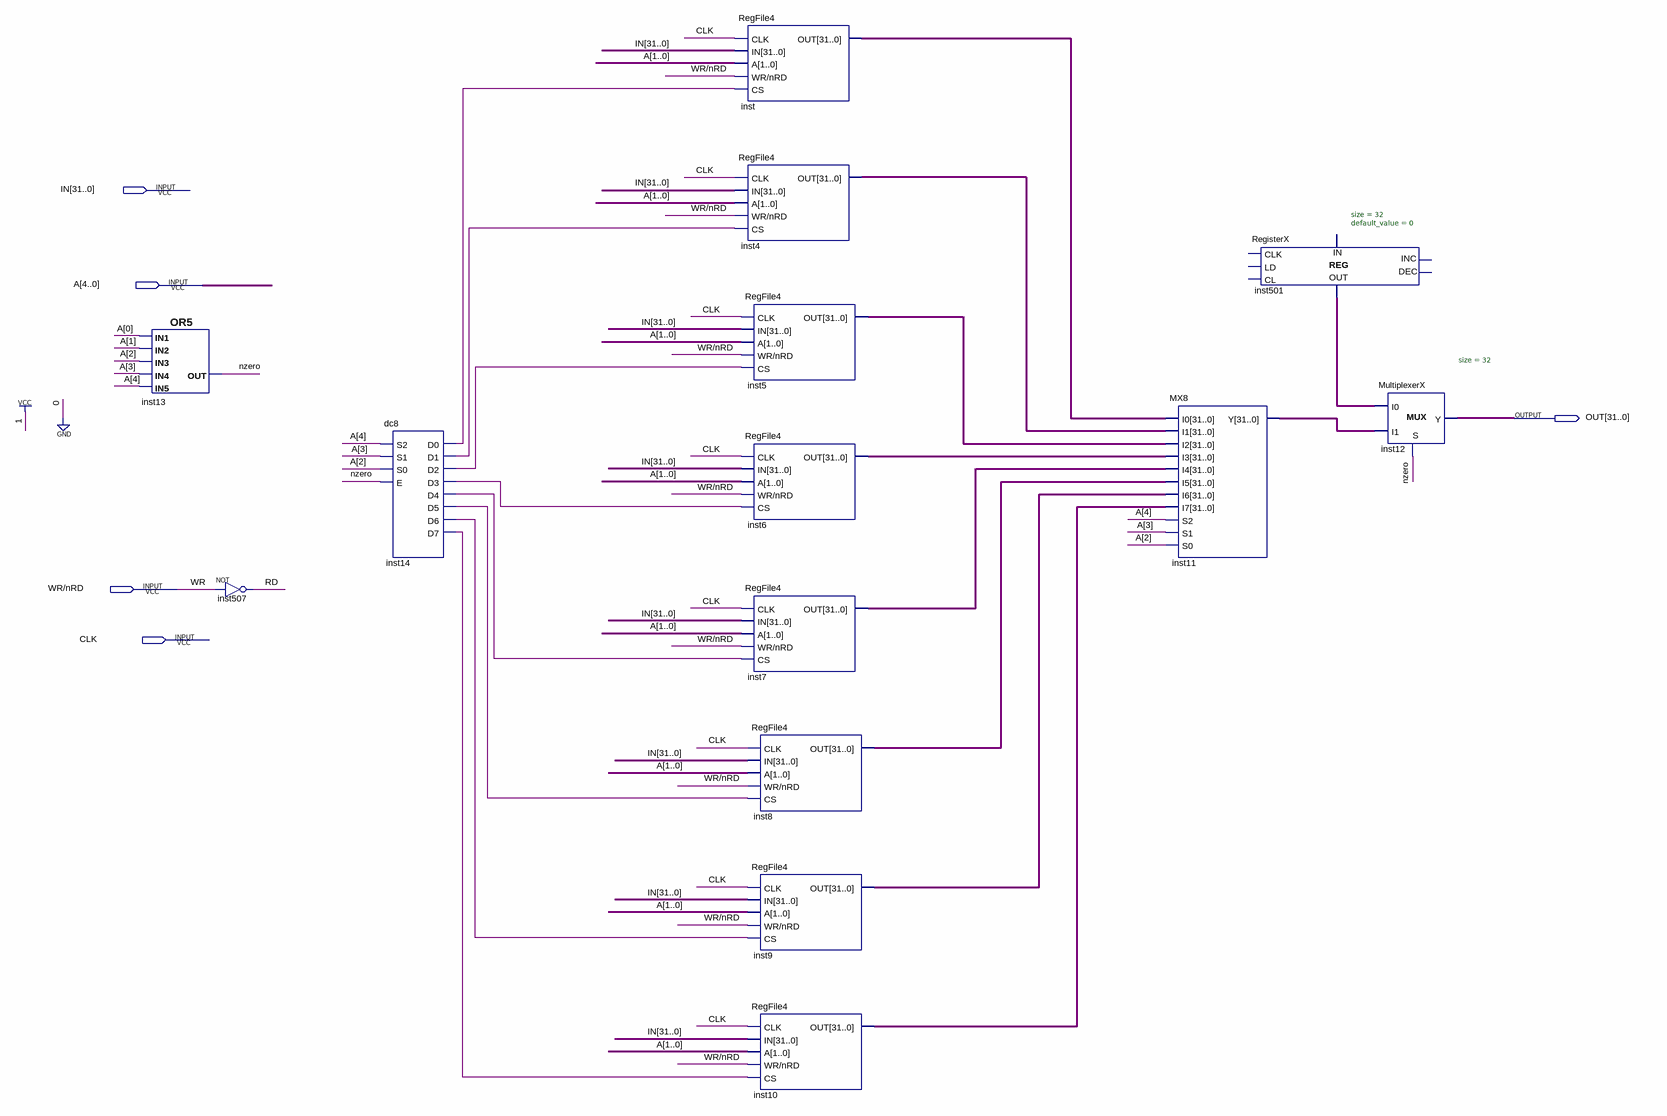
[diagram p0: schematic sheet]
// Quartus schematic RegFile32.bdf as structural Verilog: 14 symbols, 5 pins
module RegFile32 (
  input  [31:0] IN,
  input  [4:0] A,
  input  \WR/nRD ,
  input  CLK,
  output [31:0] OUT
);

  wire inst14_d0, inst14_d1, inst14_d2, inst14_d3, inst14_d4, inst14_d5, inst14_d6, inst14_d7, nzero, RD;
  wire [31:0] inst4_out, inst5_out, inst6_out, inst7_out, inst8_out, inst9_out, inst10_out, inst11_y,
       inst501_data_out, inst_out;

  or inst13 (nzero, A[0], A[1], A[2], A[3], A[4]);
  not inst507 (RD, \WR/nRD );
  dc8 inst14 (
    .S2(A[4]), .S1(A[3]), .S0(A[2]), .E(nzero), .D0(inst14_d0), .D1(inst14_d1), .D2(inst14_d2),
    .D3(inst14_d3), .D4(inst14_d4), .D5(inst14_d5), .D6(inst14_d6), .D7(inst14_d7));
  RegFile4 inst (.CLK(CLK), .IN(IN), .A(A[1:0]), .\WR/nRD (\WR/nRD ), .CS(inst14_d0), .OUT(inst_out));
  RegFile4 inst4 (.CLK(CLK), .IN(IN), .A(A[1:0]), .\WR/nRD (\WR/nRD ), .CS(inst14_d1), .OUT(inst4_out));
  RegFile4 inst5 (.CLK(CLK), .IN(IN), .A(A[1:0]), .\WR/nRD (\WR/nRD ), .CS(inst14_d2), .OUT(inst5_out));
  RegFile4 inst6 (.CLK(CLK), .IN(IN), .A(A[1:0]), .\WR/nRD (\WR/nRD ), .CS(inst14_d3), .OUT(inst6_out));
  RegFile4 inst7 (.CLK(CLK), .IN(IN), .A(A[1:0]), .\WR/nRD (\WR/nRD ), .CS(inst14_d4), .OUT(inst7_out));
  RegFile4 inst8 (.CLK(CLK), .IN(IN), .A(A[1:0]), .\WR/nRD (\WR/nRD ), .CS(inst14_d5), .OUT(inst8_out));
  RegFile4 inst9 (.CLK(CLK), .IN(IN), .A(A[1:0]), .\WR/nRD (\WR/nRD ), .CS(inst14_d6), .OUT(inst9_out));
  RegFile4 inst10 (.CLK(CLK), .IN(IN), .A(A[1:0]), .\WR/nRD (\WR/nRD ), .CS(inst14_d7), .OUT(inst10_out));
  MX8 inst11 (
    .I0(inst_out), .I1(inst4_out), .I2(inst5_out), .I3(inst6_out), .I4(inst7_out), .I5(inst8_out),
    .I6(inst9_out), .I7(inst10_out), .S2(A[4]), .S1(A[3]), .S0(A[2]), .Y(inst11_y));
  RegisterX #(.size(32), .default_value(0)) inst501 (.DATA_OUT(inst501_data_out));  // open: CLK, LD, CL, INC, DEC, DATA_IN
  MultiplexerX #(.size(32)) inst12 (.S(nzero), .I0(inst501_data_out), .I1(inst11_y), .Y(OUT));

  // Other names for the same wires on the sheet: WR = \WR/nRD 
endmodule
